# EAGLE board HighVoltageMeasurementModule_1000V_multimax (EAGLE 9.6.2)
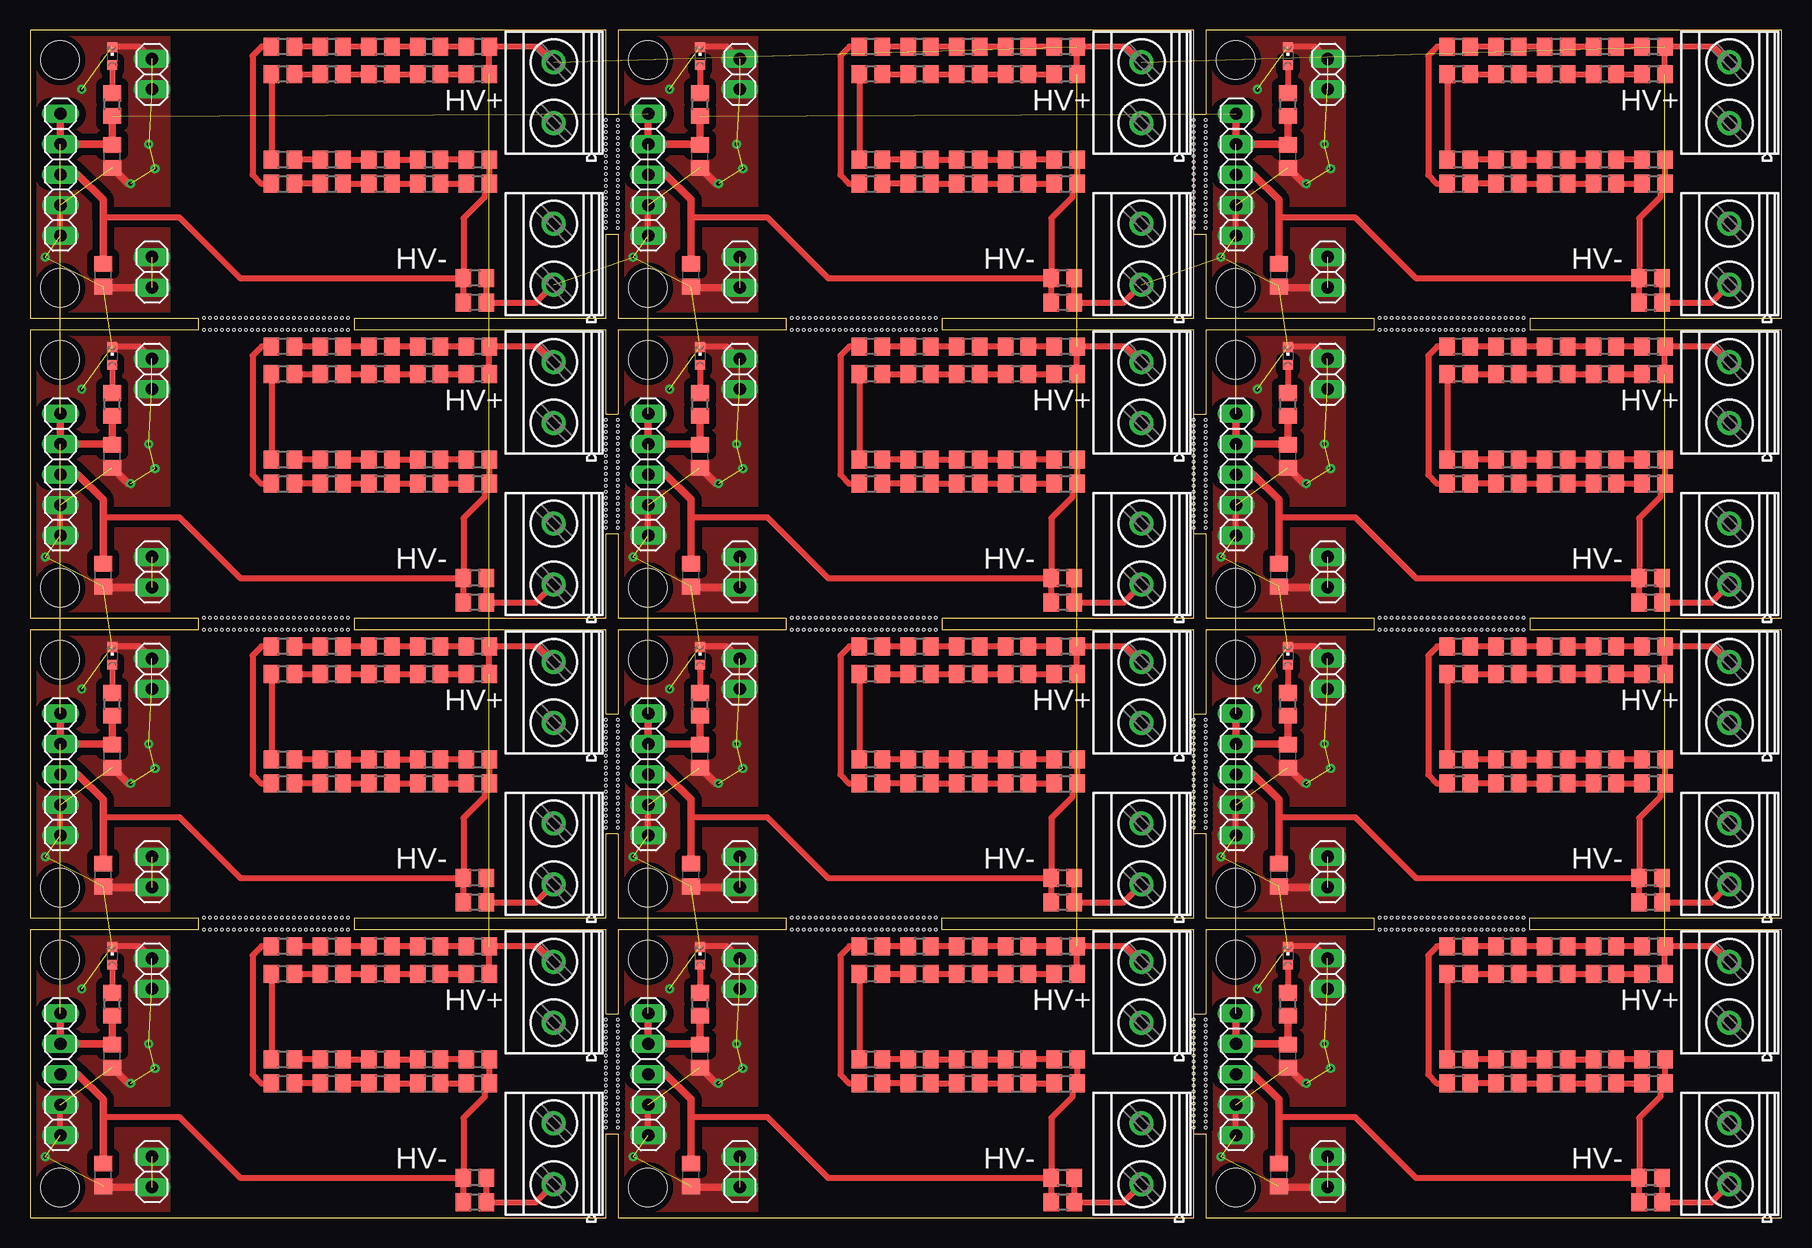
[diagram p3: board, top side]
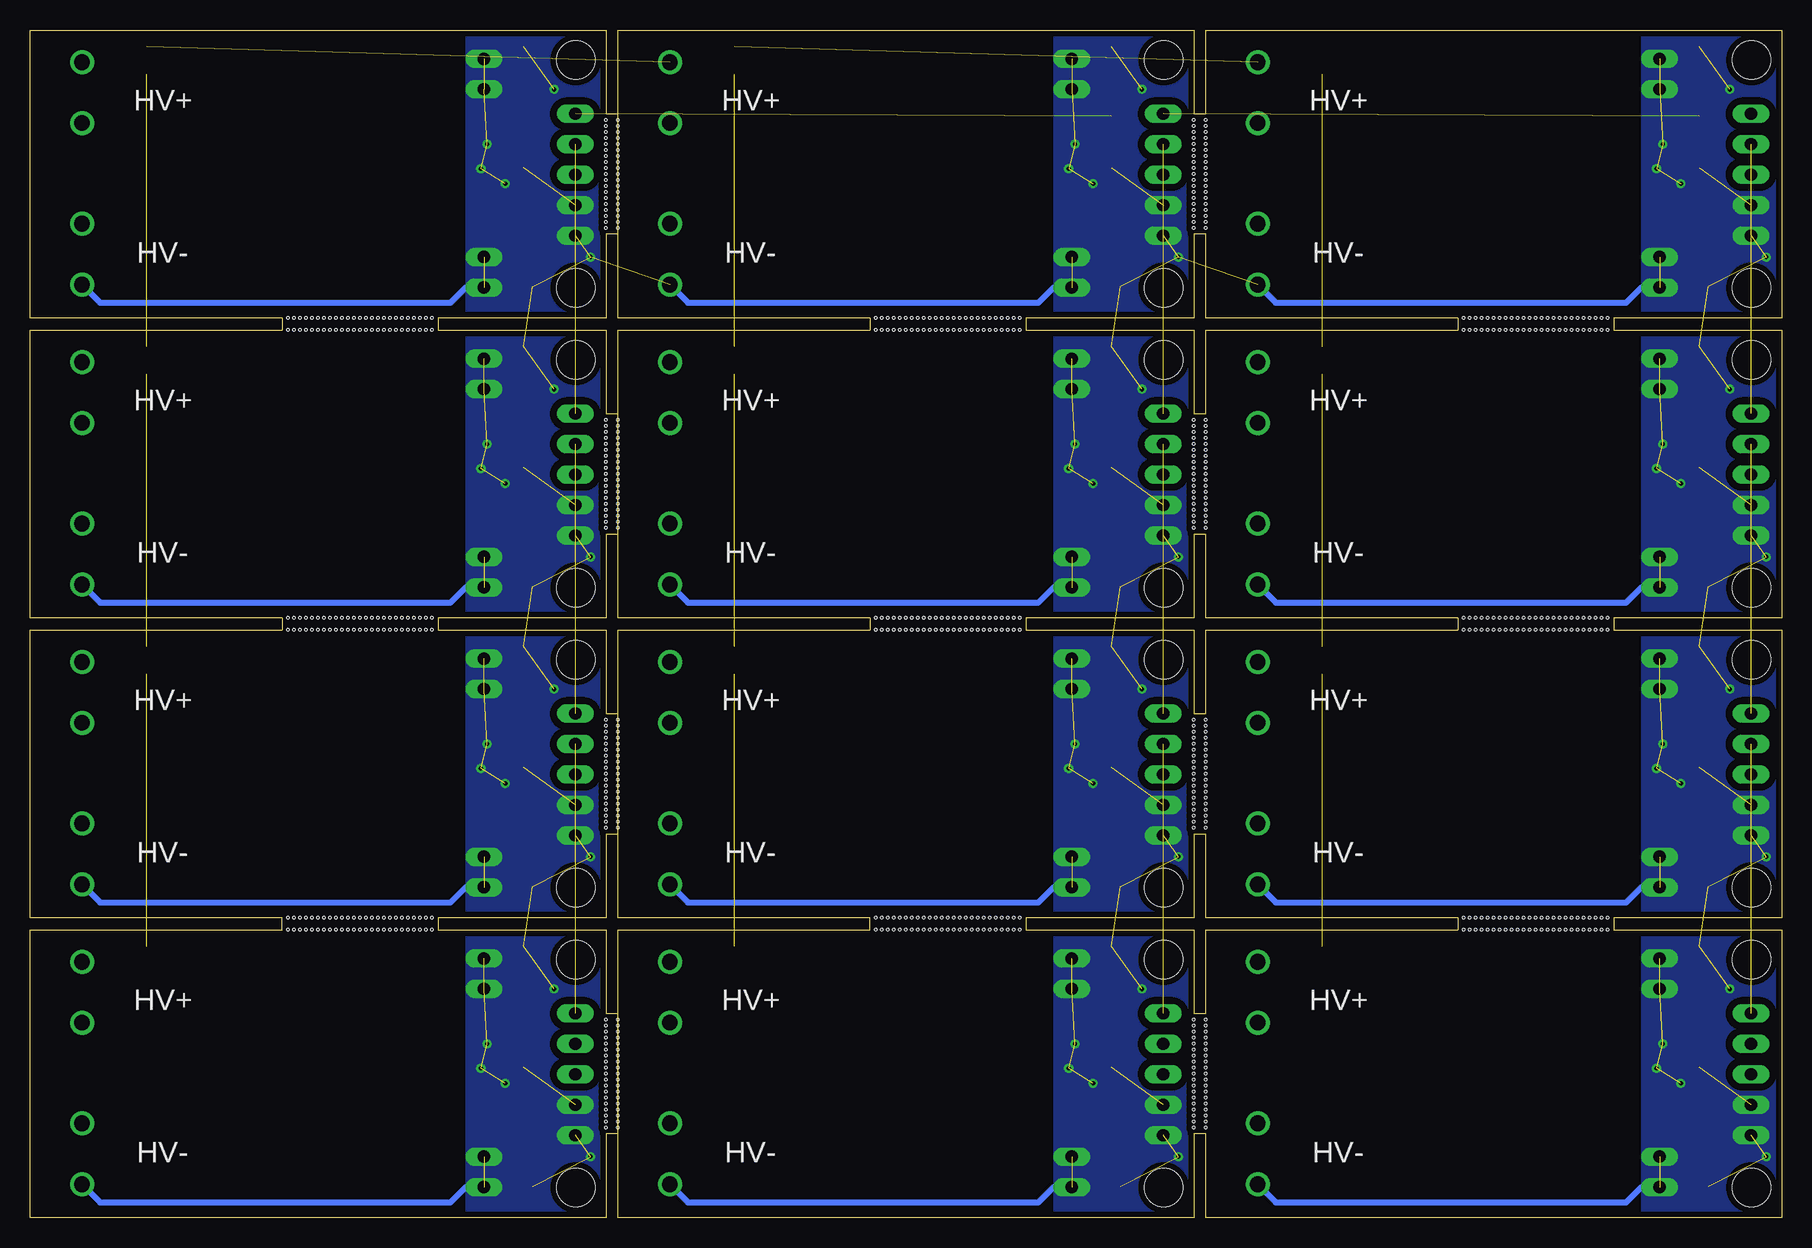
[diagram p4: board, bottom side, seen from below]

Size 146 x 99 mm. Coordinates in mm from the lower left corner, seen from the top.
Outline: 49,0 97,0
Outline: 97,0 97,24
Outline: 97,24 76,24
Outline: 49,0 49,7 48,7 48,0 0,0 0,24 14,24 14,25 0,25 0,49 14,49 14,50 0,50 0,74 14,74 14,75 0,75 0,99 48,99 48,92 49,92 49,99
Outline: 76,25 97,25
Outline: 97,25 97,49
Outline: 97,49 76,49
Outline: 76,50 97,50
Outline: 97,50 97,74
Outline: 97,74 76,74
Outline: 76,75 97,75
Outline: 97,75 97,99
Outline: 97,99 49,99
Outline: 76,75 76,74
Outline: 76,50 76,49
Outline: 76,24 76,25
Outline: 49,0 97,0
Outline: 97,0 97,7 98,7 98,0 146,0 146,24 125,24 125,25 146,25 146,49 125,49 125,50 146,50 146,74 125,74 125,75 146,75 146,99 98,99 98,92 97,92 97,99
Outline: 97,24 97,17 98,17 98,24 112,24 112,25 98,25 98,32 97,32 97,25
Outline: 97,24 76,24
Outline: 76,25 97,25
Outline: 97,49 97,42 98,42 98,49 112,49 112,50 98,50 98,57 97,57 97,50
Outline: 97,49 76,49
Outline: 76,50 97,50
Outline: 97,74 97,67 98,67 98,74 112,74 112,75 98,75 98,82 97,82 97,75
Outline: 97,74 76,74
Outline: 76,75 97,75
Outline: 97,99 49,99
Outline: 48,17 48,24 27,24 27,25 48,25 48,32 49,32 49,25 63,25 63,24 49,24 49,17 48,17
Outline: 48,42 48,49 27,49 27,50 48,50 48,57 49,57 49,50 63,50 63,49 49,49 49,42 48,42
Outline: 48,67 48,74 27,74 27,75 48,75 48,82 49,82 49,75 63,75 63,74 49,74 49,67 48,67
Copper layers (1*16): Top 0.035mm / dielectric 1.5mm / Bottom 0.035mm
Design rules "default *": minimum track width 6mil, minimum drill 0.35mm, track to track 24mil, track to pad 24mil, pad to pad 6mil, via to via 6mil, smd to smd 6mil, copper to edge 20mil, drill to drill 6mil, minimum pad ring 10mil, minimum via ring 8mil, stop-mask expansion 4mil, vias tented up to drill 0mil, thermal gap 10mil
Holes 3.2 mm at 2.5,21.5 2.5,2.5 51.5,21.5 51.5,2.5 2.5,46.5 2.5,27.5 51.5,46.5 51.5,27.5 2.5,71.5 2.5,52.5 51.5,71.5 51.5,52.5 2.5,96.5 2.5,77.5 51.5,96.5 51.5,77.5 100.5,21.5 100.5,2.5 100.5,46.5 100.5,27.5 100.5,71.5 100.5,52.5 100.5,96.5 100.5,77.5
Holes 0.2 mm at 14.5,75 14.5,74 15,74 15.5,74 16,74 16.5,74 17.5,74 17,74 18,74 18.5,74 19,74 19.5,74 20,74 20.5,74 21,74 21.5,74 22,74 23,74 22.5,74 23.5,74 24,74 24.5,74 25.5,74 26,74 25,74 26.5,74 26.5,75 26,75 25.5,75 25,75 24.5,75 24,75 23.5,75 23,75 22.5,75 22,75 21.5,75 21,75 20.5,75 20,75 19.5,75 19,75 18.5,75 18,75 17.5,75 17,75 16.5,75 16,75 15.5,75 15,75 63.5,75 63.5,74 64,74 64.5,74 65,74 65.5,74 66.5,74 66,74 67,74 67.5,74 68,74 68.5,74 69,74 69.5,74 70,74 70.5,74 71,74 72,74 71.5,74 72.5,74 73,74 73.5,74 74.5,74 75,74 74,74 75.5,74 75.5,75 75,75 74.5,75 74,75 73.5,75 73,75 72.5,75 72,75 71.5,75 71,75 70.5,75 70,75 69.5,75 69,75 68.5,75 68,75 67.5,75 67,75 66.5,75 66,75 65.5,75 65,75 64.5,75 64,75 63.5,50 63.5,49 64,49 64.5,49 65,49 65.5,49 66.5,49 66,49 67,49 67.5,49 68,49 68.5,49 69,49 69.5,49 70,49 70.5,49 71,49 72,49 71.5,49 72.5,49 73,49 73.5,49 74.5,49 75,49 74,49 75.5,49 75.5,50 75,50 74.5,50 74,50 73.5,50 73,50 72.5,50 72,50 71.5,50 71,50 70.5,50 70,50 69.5,50 69,50 68.5,50 68,50 67.5,50 67,50 66.5,50 66,50 65.5,50 65,50 64.5,50 64,50 14.5,50 14.5,49 15,49 15.5,49 16,49 16.5,49 17.5,49 17,49 18,49 18.5,49 19,49 19.5,49 20,49 20.5,49 21,49 21.5,49 22,49 23,49 22.5,49 23.5,49 24,49 24.5,49 25.5,49 26,49 25,49 26.5,49 26.5,50 26,50 25.5,50 25,50 24.5,50 24,50 23.5,50 23,50 22.5,50 22,50 21.5,50 21,50 20.5,50 20,50 19.5,50 19,50 18.5,50 18,50 17.5,50 17,50 16.5,50 16,50 15.5,50 15,50 14.5,25 14.5,24 15,24 15.5,24 16,24 16.5,24 17.5,24 17,24 18,24 18.5,24 19,24 19.5,24 20,24 20.5,24 21,24 21.5,24 22,24 23,24 22.5,24 23.5,24 24,24 24.5,24 25.5,24 26,24 25,24 26.5,24 26.5,25 26,25 25.5,25 25,25 24.5,25 24,25 23.5,25 23,25 22.5,25 22,25 21.5,25 21,25 20.5,25 20,25 19.5,25 19,25 18.5,25 18,25 17.5,25 17,25 16.5,25 16,25 15.5,25 15,25 63.5,25 63.5,24 64,24 64.5,24 65,24 65.5,24 66.5,24 66,24 67,24 67.5,24 68,24 68.5,24 69,24 69.5,24 70,24 70.5,24 71,24 72,24 71.5,24 72.5,24 73,24 73.5,24 74.5,24 75,24 74,24 75.5,24 75.5,25 75,25 74.5,25 74,25 73.5,25 73,25 72.5,25 72,25 71.5,25 71,25 70.5,25 70,25 69.5,25 69,25 68.5,25 68,25 67.5,25 67,25 66.5,25 66,25 65.5,25 65,25 64.5,25 64,25 48,7.5 49,7.5 49,8 48,8 48,8.5 49,8.5 49,9 48,9 48,9.5 49,9.5 49,10 49,10.5 49,11 49,11.5 49,12 49,12.5 49,13 49,13.5 49,14 49,15 49,14.5 49,15.5 49,16 49,16.5 48,16.5 48,16 48,15.5 48,15 48,14.5 48,14 48,13.5 48,13 48,12.5 48,12 48,11.5 48,11 48,10.5 48,10 48,32.5 49,32.5 49,33 48,33 48,33.5 49,33.5 49,34 48,34 48,34.5 49,34.5 49,35 49,35.5 49,36 49,36.5 49,37 49,37.5 49,38 49,38.5 49,39 49,40 49,39.5 49,40.5 49,41 49,41.5 48,41.5 48,41 48,40.5 48,40 48,39.5 48,39 48,38.5 48,38 48,37.5 48,37 48,36.5 48,36 48,35.5 48,35 48,57.5 49,57.5 49,58 48,58 48,58.5 49,58.5 49,59 48,59 48,59.5 49,59.5 49,60 49,60.5 49,61 49,61.5 49,62 49,62.5 49,63 49,63.5 49,64 49,65 49,64.5 49,65.5 49,66 49,66.5 48,66.5 48,66 48,65.5 48,65 48,64.5 48,64 48,63.5 48,63 48,62.5 48,62 48,61.5 48,61 48,60.5 48,60 48,82.5 49,82.5 49,83 48,83 48,83.5 49,83.5 49,84 48,84 48,84.5 49,84.5 49,85 49,85.5 49,86 49,86.5 49,87 49,87.5 49,88 49,88.5 49,89 49,90 49,89.5 49,90.5 49,91 49,91.5 48,91.5 48,91 48,90.5 48,90 48,89.5 48,89 48,88.5 48,88 48,87.5 48,87 48,86.5 48,86 48,85.5 48,85 112.5,75 112.5,74 113,74 113.5,74 114,74 114.5,74 115.5,74 115,74 116,74 116.5,74 117,74 117.5,74 118,74 118.5,74 119,74 119.5,74 120,74 121,74 120.5,74 121.5,74 122,74 122.5,74 123.5,74 124,74 123,74 124.5,74 124.5,75 124,75 123.5,75 123,75 122.5,75 122,75 121.5,75 121,75 120.5,75 120,75 119.5,75 119,75 118.5,75 118,75 117.5,75 117,75 116.5,75 116,75 115.5,75 115,75 114.5,75 114,75 113.5,75 113,75 112.5,50 112.5,49 113,49 113.5,49 114,49 114.5,49 115.5,49 115,49 116,49 116.5,49 117,49 117.5,49 118,49 118.5,49 119,49 119.5,49 120,49 121,49 120.5,49 121.5,49 122,49 122.5,49 123.5,49 124,49 123,49 124.5,49 124.5,50 124,50 123.5,50 123,50 122.5,50 122,50 121.5,50 121,50 120.5,50 120,50 119.5,50 119,50 118.5,50 118,50 117.5,50 117,50 116.5,50 116,50 115.5,50 115,50 114.5,50 114,50 113.5,50 113,50 112.5,25 112.5,24 113,24 113.5,24 114,24 114.5,24 115.5,24 115,24 116,24 116.5,24 117,24 117.5,24 118,24 118.5,24 119,24 119.5,24 120,24 121,24 120.5,24 121.5,24 122,24 122.5,24 123.5,24 124,24 123,24 124.5,24 124.5,25 124,25 123.5,25 123,25 122.5,25 122,25 121.5,25 121,25 120.5,25 120,25 119.5,25 119,25 118.5,25 118,25 117.5,25 117,25 116.5,25 116,25 115.5,25 115,25 114.5,25 114,25 113.5,25 113,25 97,7.5 98,7.5 98,8 97,8 97,8.5 98,8.5 98,9 97,9 97,9.5 98,9.5 98,10 98,10.5 98,11 98,11.5 98,12 98,12.5 98,13 98,13.5 98,14 98,15 98,14.5 98,15.5 98,16 98,16.5 97,16.5 97,16 97,15.5 97,15 97,14.5 97,14 97,13.5 97,13 97,12.5 97,12 97,11.5 97,11 97,10.5 97,10 97,32.5 98,32.5 98,33 97,33 97,33.5 98,33.5 98,34 97,34 97,34.5 98,34.5 98,35 98,35.5 98,36 98,36.5 98,37 98,37.5 98,38 98,38.5 98,39 98,40 98,39.5 98,40.5 98,41 98,41.5 97,41.5 97,41 97,40.5 97,40 97,39.5 97,39 97,38.5 97,38 97,37.5 97,37 97,36.5 97,36 97,35.5 97,35 97,57.5 98,57.5 98,58 97,58 97,58.5 98,58.5 98,59 97,59 97,59.5 98,59.5 98,60 98,60.5 98,61 98,61.5 98,62 98,62.5 98,63 98,63.5 98,64 98,65 98,64.5 98,65.5 98,66 98,66.5 97,66.5 97,66 97,65.5 97,65 97,64.5 97,64 97,63.5 97,63 97,62.5 97,62 97,61.5 97,61 97,60.5 97,60 97,82.5 98,82.5 98,83 97,83 97,83.5 98,83.5 98,84 97,84 97,84.5 98,84.5 98,85 98,85.5 98,86 98,86.5 98,87 98,87.5 98,88 98,88.5 98,89 98,90 98,89.5 98,90.5 98,91 98,91.5 97,91.5 97,91 97,90.5 97,90 97,89.5 97,89 97,88.5 97,88 97,87.5 97,87 97,86.5 97,86 97,85.5 97,85

## Footprints (pad centres in the part's own frame; a part is rotated, then mirrored left to right if it is on the bottom)
C0805 = smd 1.3 x 1.5: 1 -0.95,0; 2 0.95,0
1X05 = drill 1.016 long: 1 -5.08,0; 2 -2.54,0; 3 0,0; 4 2.54,0; 5 5.08,0
1X02 = drill 1.016 long: 1 -1.27,0; 2 1.27,0
CHIPLED_0603 = smd 0.8 x 0.8: A 0,-0.75; C 0,0.75
R0805 = smd 1.3 x 1.5: 1 -0.95,0; 2 0.95,0
MKDSN1,5/2-5,08 = drill 1.3 pad 2: 1 -2.561,0.025; 2 2.519,0.025

## Placement (x,y rotation side)
C1  100nF  [C0805]  6.86,13.46 90 top
C2  10nF  [C0805]  6.1,3.56 90 top
C5  100nF  [C0805]  6.86,38.46 90 top
C6  10nF  [C0805]  6.1,28.56 90 top
C7  100nF  [C0805]  6.86,63.46 90 top
C8  10nF  [C0805]  6.1,53.56 90 top
C9  100nF  [C0805]  55.86,13.46 90 top
C10  10nF  [C0805]  55.1,3.56 90 top
C11  100nF  [C0805]  6.86,88.46 90 top
C12  10nF  [C0805]  6.1,78.56 90 top
C13  100nF  [C0805]  55.86,38.46 90 top
C14  10nF  [C0805]  55.1,28.56 90 top
C15  100nF  [C0805]  55.86,63.46 90 top
C16  10nF  [C0805]  55.1,53.56 90 top
C17  100nF  [C0805]  55.86,88.46 90 top
C18  10nF  [C0805]  55.1,78.56 90 top
C25  100nF  [C0805]  104.86,13.46 90 top
C26  10nF  [C0805]  104.1,3.56 90 top
C27  100nF  [C0805]  104.86,38.46 90 top
C28  10nF  [C0805]  104.1,28.56 90 top
C29  100nF  [C0805]  104.86,63.46 90 top
C30  10nF  [C0805]  104.1,53.56 90 top
C31  100nF  [C0805]  104.86,88.46 90 top
C32  10nF  [C0805]  104.1,78.56 90 top
JP1  [1X05]  2.54,11.94 270 top
JP2  [1X02]  10.16,20.32 90 top
JP3  [1X02]  10.16,3.81 270 top
JP7  [1X05]  2.54,36.94 270 top
JP8  [1X02]  10.16,45.32 90 top
JP9  [1X02]  10.16,28.81 270 top
JP10  [1X05]  2.54,61.94 270 top
JP11  [1X02]  10.16,70.32 90 top
JP12  [1X02]  10.16,53.81 270 top
JP13  [1X05]  51.54,11.94 270 top
JP14  [1X02]  59.16,20.32 90 top
JP15  [1X02]  59.16,3.81 270 top
JP16  [1X05]  2.54,86.94 270 top
JP17  [1X02]  10.16,95.32 90 top
JP18  [1X02]  10.16,78.81 270 top
JP19  [1X05]  51.54,36.94 270 top
JP20  [1X02]  59.16,45.32 90 top
JP21  [1X02]  59.16,28.81 270 top
JP22  [1X05]  51.54,61.94 270 top
JP23  [1X02]  59.16,70.32 90 top
JP24  [1X02]  59.16,53.81 270 top
JP25  [1X05]  51.54,86.94 270 top
JP26  [1X02]  59.16,95.32 90 top
JP27  [1X02]  59.16,78.81 270 top
JP37  [1X05]  100.54,11.94 270 top
JP38  [1X02]  108.16,20.32 90 top
JP39  [1X02]  108.16,3.81 270 top
JP40  [1X05]  100.54,36.94 270 top
JP41  [1X02]  108.16,45.32 90 top
JP42  [1X02]  108.16,28.81 270 top
JP43  [1X05]  100.54,61.94 270 top
JP44  [1X02]  108.16,70.32 90 top
JP45  [1X02]  108.16,53.81 270 top
JP46  [1X05]  100.54,86.94 270 top
JP47  [1X02]  108.16,95.32 90 top
JP48  [1X02]  108.16,78.81 270 top
LED1  KT-0603R  [CHIPLED_0603]  6.86,21.84 0 top
LED3  KT-0603R  [CHIPLED_0603]  6.86,46.84 0 top
LED4  KT-0603R  [CHIPLED_0603]  6.86,71.84 0 top
LED5  KT-0603R  [CHIPLED_0603]  55.86,21.84 0 top
LED6  KT-0603R  [CHIPLED_0603]  6.86,96.84 0 top
LED7  KT-0603R  [CHIPLED_0603]  55.86,46.84 0 top
LED8  KT-0603R  [CHIPLED_0603]  55.86,71.84 0 top
LED9  KT-0603R  [CHIPLED_0603]  55.86,96.84 0 top
LED13  KT-0603R  [CHIPLED_0603]  104.86,21.84 0 top
LED14  KT-0603R  [CHIPLED_0603]  104.86,46.84 0 top
LED15  KT-0603R  [CHIPLED_0603]  104.86,71.84 0 top
LED16  KT-0603R  [CHIPLED_0603]  104.86,96.84 0 top
R1  1k  [R0805]  6.86,17.78 90 top
R2  200k  [R0805]  37.34,20.32 180 top
R3  200k  [R0805]  37.34,22.61 180 top
R4  200k  [R0805]  33.27,20.32 180 top
R5  200k  [R0805]  29.21,20.32 180 top
R6  200k  [R0805]  25.15,20.32 180 top
R7  200k  [R0805]  21.08,20.32 180 top
R8  200k  [R0805]  33.27,22.61 180 top
R9  200k  [R0805]  21.08,13.21 0 top
R10  200k  [R0805]  25.15,13.21 0 top
R11  200k  [R0805]  29.21,13.21 0 top
R12  200k  [R0805]  33.27,13.21 0 top
R13  200k  [R0805]  29.21,22.61 180 top
R14  200k  [R0805]  37.34,13.21 0 top
R15  10k  [R0805]  37.08,1.27 180 top
R18  200k  [R0805]  25.15,22.61 180 top
R23  200k  [R0805]  21.08,22.61 180 top
R28  200k  [R0805]  21.08,11.18 0 top
R33  200k  [R0805]  25.15,11.18 0 top
R38  200k  [R0805]  29.21,11.18 0 top
R43  200k  [R0805]  33.27,11.18 0 top
R45  200k  [R0805]  37.34,11.18 0 top
R46  1k  [R0805]  6.86,42.78 90 top
R47  200k  [R0805]  37.34,47.61 180 top
R48  200k  [R0805]  33.27,47.61 180 top
R49  200k  [R0805]  29.21,47.61 180 top
R50  200k  [R0805]  25.15,47.61 180 top
R51  200k  [R0805]  21.08,47.61 180 top
R52  200k  [R0805]  21.08,36.18 0 top
R53  10k  [R0805]  37.08,3.3 180 top
R54  200k  [R0805]  25.15,36.18 0 top
R55  200k  [R0805]  29.21,36.18 0 top
R56  200k  [R0805]  33.27,36.18 0 top
R57  200k  [R0805]  37.34,36.18 0 top
R58  10k  [R0805]  37.08,28.3 180 top
R59  200k  [R0805]  37.34,45.32 180 top
R60  200k  [R0805]  33.27,45.32 180 top
R61  200k  [R0805]  29.21,45.32 180 top
R62  200k  [R0805]  25.15,45.32 180 top
R63  200k  [R0805]  21.08,45.32 180 top
R64  200k  [R0805]  21.08,38.21 0 top
R65  200k  [R0805]  25.15,38.21 0 top
R66  200k  [R0805]  29.21,38.21 0 top
R67  200k  [R0805]  33.27,38.21 0 top
R68  200k  [R0805]  37.34,38.21 0 top
R69  10k  [R0805]  37.08,26.27 180 top
R70  1k  [R0805]  6.86,67.78 90 top
R71  200k  [R0805]  37.34,72.61 180 top
R72  200k  [R0805]  33.27,72.61 180 top
R73  200k  [R0805]  29.21,72.61 180 top
R74  200k  [R0805]  25.15,72.61 180 top
R75  200k  [R0805]  21.08,72.61 180 top
R76  200k  [R0805]  21.08,61.18 0 top
R77  200k  [R0805]  25.15,61.18 0 top
R78  200k  [R0805]  29.21,61.18 0 top
R79  200k  [R0805]  33.27,61.18 0 top
R80  200k  [R0805]  37.34,61.18 0 top
R81  10k  [R0805]  37.08,53.3 180 top
R82  200k  [R0805]  37.34,70.32 180 top
R83  200k  [R0805]  33.27,70.32 180 top
R84  200k  [R0805]  29.21,70.32 180 top
R85  200k  [R0805]  25.15,70.32 180 top
R86  200k  [R0805]  21.08,70.32 180 top
R87  200k  [R0805]  21.08,63.21 0 top
R88  200k  [R0805]  25.15,63.21 0 top
R89  200k  [R0805]  29.21,63.21 0 top
R90  200k  [R0805]  33.27,63.21 0 top
R91  200k  [R0805]  37.34,63.21 0 top
R92  10k  [R0805]  37.08,51.27 180 top
R93  1k  [R0805]  55.86,17.78 90 top
R94  200k  [R0805]  86.34,22.61 180 top
R95  200k  [R0805]  82.27,22.61 180 top
R96  200k  [R0805]  78.21,22.61 180 top
R97  200k  [R0805]  74.15,22.61 180 top
R98  200k  [R0805]  70.08,22.61 180 top
R99  200k  [R0805]  70.08,11.18 0 top
R100  200k  [R0805]  74.15,11.18 0 top
R101  200k  [R0805]  78.21,11.18 0 top
R102  200k  [R0805]  82.27,11.18 0 top
R103  200k  [R0805]  86.34,11.18 0 top
R104  10k  [R0805]  86.08,3.3 180 top
R105  200k  [R0805]  86.34,20.32 180 top
R106  200k  [R0805]  82.27,20.32 180 top
R107  200k  [R0805]  78.21,20.32 180 top
R108  200k  [R0805]  74.15,20.32 180 top
R109  200k  [R0805]  70.08,20.32 180 top
R110  200k  [R0805]  70.08,13.21 0 top
R111  200k  [R0805]  74.15,13.21 0 top
R112  200k  [R0805]  78.21,13.21 0 top
R113  200k  [R0805]  82.27,13.21 0 top
R114  200k  [R0805]  86.34,13.21 0 top
R115  10k  [R0805]  86.08,1.27 180 top
R116  1k  [R0805]  6.86,92.78 90 top
R117  200k  [R0805]  37.34,97.61 180 top
R118  200k  [R0805]  33.27,97.61 180 top
R119  200k  [R0805]  29.21,97.61 180 top
R120  200k  [R0805]  25.15,97.61 180 top
R121  200k  [R0805]  21.08,97.61 180 top
R122  200k  [R0805]  21.08,86.18 0 top
R123  200k  [R0805]  25.15,86.18 0 top
R124  200k  [R0805]  29.21,86.18 0 top
R125  200k  [R0805]  33.27,86.18 0 top
R126  200k  [R0805]  37.34,86.18 0 top
R127  10k  [R0805]  37.08,78.3 180 top
R128  200k  [R0805]  37.34,95.32 180 top
R129  200k  [R0805]  33.27,95.32 180 top
R130  200k  [R0805]  29.21,95.32 180 top
R131  200k  [R0805]  25.15,95.32 180 top
R132  200k  [R0805]  21.08,95.32 180 top
R133  200k  [R0805]  21.08,88.21 0 top
R134  200k  [R0805]  25.15,88.21 0 top
R135  200k  [R0805]  29.21,88.21 0 top
R136  200k  [R0805]  33.27,88.21 0 top
R137  200k  [R0805]  37.34,88.21 0 top
R138  10k  [R0805]  37.08,76.27 180 top
R139  1k  [R0805]  55.86,42.78 90 top
R140  200k  [R0805]  86.34,47.61 180 top
R141  200k  [R0805]  82.27,47.61 180 top
R142  200k  [R0805]  78.21,47.61 180 top
R143  200k  [R0805]  74.15,47.61 180 top
R144  200k  [R0805]  70.08,47.61 180 top
R145  200k  [R0805]  70.08,36.18 0 top
R146  200k  [R0805]  74.15,36.18 0 top
R147  200k  [R0805]  78.21,36.18 0 top
R148  200k  [R0805]  82.27,36.18 0 top
R149  200k  [R0805]  86.34,36.18 0 top
R150  10k  [R0805]  86.08,28.3 180 top
R151  200k  [R0805]  86.34,45.32 180 top
R152  200k  [R0805]  82.27,45.32 180 top
R153  200k  [R0805]  78.21,45.32 180 top
R154  200k  [R0805]  74.15,45.32 180 top
R155  200k  [R0805]  70.08,45.32 180 top
R156  200k  [R0805]  70.08,38.21 0 top
R157  200k  [R0805]  74.15,38.21 0 top
R158  200k  [R0805]  78.21,38.21 0 top
R159  200k  [R0805]  82.27,38.21 0 top
R160  200k  [R0805]  86.34,38.21 0 top
R161  10k  [R0805]  86.08,26.27 180 top
R162  1k  [R0805]  55.86,67.78 90 top
R163  200k  [R0805]  86.34,72.61 180 top
R164  200k  [R0805]  82.27,72.61 180 top
R165  200k  [R0805]  78.21,72.61 180 top
R166  200k  [R0805]  74.15,72.61 180 top
R167  200k  [R0805]  70.08,72.61 180 top
R168  200k  [R0805]  70.08,61.18 0 top
R169  200k  [R0805]  74.15,61.18 0 top
R170  200k  [R0805]  78.21,61.18 0 top
R171  200k  [R0805]  82.27,61.18 0 top
R172  200k  [R0805]  86.34,61.18 0 top
R173  10k  [R0805]  86.08,53.3 180 top
R174  200k  [R0805]  86.34,70.32 180 top
R175  200k  [R0805]  82.27,70.32 180 top
R176  200k  [R0805]  78.21,70.32 180 top
R177  200k  [R0805]  74.15,70.32 180 top
R178  200k  [R0805]  70.08,70.32 180 top
R179  200k  [R0805]  70.08,63.21 0 top
R180  200k  [R0805]  74.15,63.21 0 top
R181  200k  [R0805]  78.21,63.21 0 top
R182  200k  [R0805]  82.27,63.21 0 top
R183  200k  [R0805]  86.34,63.21 0 top
R184  10k  [R0805]  86.08,51.27 180 top
R185  1k  [R0805]  55.86,92.78 90 top
R186  200k  [R0805]  86.34,97.61 180 top
R187  200k  [R0805]  82.27,97.61 180 top
R188  200k  [R0805]  78.21,97.61 180 top
R189  200k  [R0805]  74.15,97.61 180 top
R190  200k  [R0805]  70.08,97.61 180 top
R191  200k  [R0805]  70.08,86.18 0 top
R192  200k  [R0805]  74.15,86.18 0 top
R193  200k  [R0805]  78.21,86.18 0 top
R194  200k  [R0805]  82.27,86.18 0 top
R195  200k  [R0805]  86.34,86.18 0 top
R196  10k  [R0805]  86.08,78.3 180 top
R197  200k  [R0805]  86.34,95.32 180 top
R198  200k  [R0805]  82.27,95.32 180 top
R199  200k  [R0805]  78.21,95.32 180 top
R200  200k  [R0805]  74.15,95.32 180 top
R201  200k  [R0805]  70.08,95.32 180 top
R202  200k  [R0805]  70.08,88.21 0 top
R203  200k  [R0805]  74.15,88.21 0 top
R204  200k  [R0805]  78.21,88.21 0 top
R205  200k  [R0805]  82.27,88.21 0 top
R206  200k  [R0805]  86.34,88.21 0 top
R207  10k  [R0805]  86.08,76.27 180 top
R277  1k  [R0805]  104.86,17.78 90 top
R278  200k  [R0805]  135.34,22.61 180 top
R279  200k  [R0805]  131.27,22.61 180 top
R280  200k  [R0805]  127.21,22.61 180 top
R281  200k  [R0805]  123.15,22.61 180 top
R282  200k  [R0805]  119.08,22.61 180 top
R283  200k  [R0805]  119.08,11.18 0 top
R284  200k  [R0805]  123.15,11.18 0 top
R285  200k  [R0805]  127.21,11.18 0 top
R286  200k  [R0805]  131.27,11.18 0 top
R287  200k  [R0805]  135.34,11.18 0 top
R288  10k  [R0805]  135.08,3.3 180 top
R289  200k  [R0805]  135.34,20.32 180 top
R290  200k  [R0805]  131.27,20.32 180 top
R291  200k  [R0805]  127.21,20.32 180 top
R292  200k  [R0805]  123.15,20.32 180 top
R293  200k  [R0805]  119.08,20.32 180 top
R294  200k  [R0805]  119.08,13.21 0 top
R295  200k  [R0805]  123.15,13.21 0 top
R296  200k  [R0805]  127.21,13.21 0 top
R297  200k  [R0805]  131.27,13.21 0 top
R298  200k  [R0805]  135.34,13.21 0 top
R299  10k  [R0805]  135.08,1.27 180 top
R300  1k  [R0805]  104.86,42.78 90 top
R301  200k  [R0805]  135.34,47.61 180 top
R302  200k  [R0805]  131.27,47.61 180 top
R303  200k  [R0805]  127.21,47.61 180 top
R304  200k  [R0805]  123.15,47.61 180 top
R305  200k  [R0805]  119.08,47.61 180 top
R306  200k  [R0805]  119.08,36.18 0 top
R307  200k  [R0805]  123.15,36.18 0 top
R308  200k  [R0805]  127.21,36.18 0 top
R309  200k  [R0805]  131.27,36.18 0 top
R310  200k  [R0805]  135.34,36.18 0 top
R311  10k  [R0805]  135.08,28.3 180 top
R312  200k  [R0805]  135.34,45.32 180 top
R313  200k  [R0805]  131.27,45.32 180 top
R314  200k  [R0805]  127.21,45.32 180 top
R315  200k  [R0805]  123.15,45.32 180 top
R316  200k  [R0805]  119.08,45.32 180 top
R317  200k  [R0805]  119.08,38.21 0 top
R318  200k  [R0805]  123.15,38.21 0 top
R319  200k  [R0805]  127.21,38.21 0 top
R320  200k  [R0805]  131.27,38.21 0 top
R321  200k  [R0805]  135.34,38.21 0 top
R322  10k  [R0805]  135.08,26.27 180 top
R323  1k  [R0805]  104.86,67.78 90 top
R324  200k  [R0805]  135.34,72.61 180 top
R325  200k  [R0805]  131.27,72.61 180 top
R326  200k  [R0805]  127.21,72.61 180 top
R327  200k  [R0805]  123.15,72.61 180 top
R328  200k  [R0805]  119.08,72.61 180 top
R329  200k  [R0805]  119.08,61.18 0 top
R330  200k  [R0805]  123.15,61.18 0 top
R331  200k  [R0805]  127.21,61.18 0 top
R332  200k  [R0805]  131.27,61.18 0 top
R333  200k  [R0805]  135.34,61.18 0 top
R334  10k  [R0805]  135.08,53.3 180 top
R335  200k  [R0805]  135.34,70.32 180 top
R336  200k  [R0805]  131.27,70.32 180 top
R337  200k  [R0805]  127.21,70.32 180 top
R338  200k  [R0805]  123.15,70.32 180 top
R339  200k  [R0805]  119.08,70.32 180 top
R340  200k  [R0805]  119.08,63.21 0 top
R341  200k  [R0805]  123.15,63.21 0 top
R342  200k  [R0805]  127.21,63.21 0 top
R343  200k  [R0805]  131.27,63.21 0 top
R344  200k  [R0805]  135.34,63.21 0 top
R345  10k  [R0805]  135.08,51.27 180 top
R346  1k  [R0805]  104.86,92.78 90 top
R347  200k  [R0805]  135.34,97.61 180 top
R348  200k  [R0805]  131.27,97.61 180 top
R349  200k  [R0805]  127.21,97.61 180 top
R350  200k  [R0805]  123.15,97.61 180 top
R351  200k  [R0805]  119.08,97.61 180 top
R352  200k  [R0805]  119.08,86.18 0 top
R353  200k  [R0805]  123.15,86.18 0 top
R354  200k  [R0805]  127.21,86.18 0 top
R355  200k  [R0805]  131.27,86.18 0 top
R356  200k  [R0805]  135.34,86.18 0 top
R357  10k  [R0805]  135.08,78.3 180 top
R358  200k  [R0805]  135.34,95.32 180 top
R359  200k  [R0805]  131.27,95.32 180 top
R360  200k  [R0805]  127.21,95.32 180 top
R361  200k  [R0805]  123.15,95.32 180 top
R362  200k  [R0805]  119.08,95.32 180 top
R363  200k  [R0805]  119.08,88.21 0 top
R364  200k  [R0805]  123.15,88.21 0 top
R365  200k  [R0805]  127.21,88.21 0 top
R366  200k  [R0805]  131.27,88.21 0 top
R367  200k  [R0805]  135.34,88.21 0 top
R368  10k  [R0805]  135.08,76.27 180 top
X1  MKDSN1,5/2-5,08  [MKDSN1,5/2-5,08]  43.69,18.8 90 top
X2  MKDSN1,5/2-5,08  [MKDSN1,5/2-5,08]  43.69,5.33 90 top
X5  MKDSN1,5/2-5,08  [MKDSN1,5/2-5,08]  43.69,43.8 90 top
X6  MKDSN1,5/2-5,08  [MKDSN1,5/2-5,08]  43.69,30.33 90 top
X7  MKDSN1,5/2-5,08  [MKDSN1,5/2-5,08]  43.69,68.8 90 top
X8  MKDSN1,5/2-5,08  [MKDSN1,5/2-5,08]  43.69,55.33 90 top
X9  MKDSN1,5/2-5,08  [MKDSN1,5/2-5,08]  92.69,18.8 90 top
X10  MKDSN1,5/2-5,08  [MKDSN1,5/2-5,08]  92.69,5.33 90 top
X11  MKDSN1,5/2-5,08  [MKDSN1,5/2-5,08]  43.69,93.8 90 top
X12  MKDSN1,5/2-5,08  [MKDSN1,5/2-5,08]  43.69,80.33 90 top
X13  MKDSN1,5/2-5,08  [MKDSN1,5/2-5,08]  92.69,43.8 90 top
X14  MKDSN1,5/2-5,08  [MKDSN1,5/2-5,08]  92.69,30.33 90 top
X15  MKDSN1,5/2-5,08  [MKDSN1,5/2-5,08]  92.69,68.8 90 top
X16  MKDSN1,5/2-5,08  [MKDSN1,5/2-5,08]  92.69,55.33 90 top
X17  MKDSN1,5/2-5,08  [MKDSN1,5/2-5,08]  92.69,93.8 90 top
X18  MKDSN1,5/2-5,08  [MKDSN1,5/2-5,08]  92.69,80.33 90 top
X25  MKDSN1,5/2-5,08  [MKDSN1,5/2-5,08]  141.69,18.8 90 top
X26  MKDSN1,5/2-5,08  [MKDSN1,5/2-5,08]  141.69,5.33 90 top
X27  MKDSN1,5/2-5,08  [MKDSN1,5/2-5,08]  141.69,43.8 90 top
X28  MKDSN1,5/2-5,08  [MKDSN1,5/2-5,08]  141.69,30.33 90 top
X29  MKDSN1,5/2-5,08  [MKDSN1,5/2-5,08]  141.69,68.8 90 top
X30  MKDSN1,5/2-5,08  [MKDSN1,5/2-5,08]  141.69,55.33 90 top
X31  MKDSN1,5/2-5,08  [MKDSN1,5/2-5,08]  141.69,93.8 90 top
X32  MKDSN1,5/2-5,08  [MKDSN1,5/2-5,08]  141.69,80.33 90 top

## Tracks (layer width: path | path; a pad name or v marks a point on that pad's centre or on a via)
5VDC  (11 unrouted)
  Top 0.61: JP1.1 JP1.2 6.79,14.48 C1.2 R1.1 | JP7.1 JP7.2 6.79,39.48 C5.2 R46.1 | JP10.1 JP10.2 6.79,64.48 C7.2 R70.1 | JP16.1 JP16.2 6.79,89.48 C11.2 R116.1 | JP13.1 JP13.2 55.79,14.48 C9.2 R93.1 | JP19.1 JP19.2 55.79,39.48 C13.2 R139.1 | JP22.1 JP22.2 55.79,64.48 C15.2 R162.1 | JP25.1 JP25.2 55.79,89.48 C17.2 R185.1 | JP37.1 JP37.2 104.79,14.48 C25.2 R277.1 | JP40.1 JP40.2 104.79,39.48 C27.2 R300.1 | JP43.1 JP43.2 104.79,64.48 C29.2 R323.1 | JP46.1 JP46.2 104.79,89.48 C31.2 R346.1
GND  (via drill 0.35)  (119 unrouted)
  Top 0.508: JP2.2 9.16,22.59 LED1.C | JP1.5 JP1.4 | R53.1 R15.1 42.16,1.27 X2.1 | JP8.2 9.16,47.59 LED3.C | JP7.5 JP7.4 | R58.1 R69.1 42.16,26.27 X6.1 | JP11.2 9.16,72.59 LED4.C | JP10.5 JP10.4 | R81.1 R92.1 42.16,51.27 X8.1 | JP17.2 9.16,97.59 LED6.C | JP16.5 JP16.4 | R127.1 R138.1 42.16,76.27 X12.1 | JP14.2 58.16,22.59 LED5.C | JP13.5 JP13.4 | R104.1 R115.1 91.16,1.27 X10.1 | JP20.2 58.16,47.59 LED7.C | JP19.5 JP19.4 | R150.1 R161.1 91.16,26.27 X14.1 | JP23.2 58.16,72.59 LED8.C | JP22.5 JP22.4 | R173.1 R184.1 91.16,51.27 X16.1 | JP26.2 58.16,97.59 LED9.C | JP25.5 JP25.4 | R196.1 R207.1 91.16,76.27 X18.1 | JP38.2 107.16,22.59 LED13.C | JP37.5 JP37.4 | R288.1 R299.1 140.16,1.27 X26.1 | JP41.2 107.16,47.59 LED14.C | JP40.5 JP40.4 | R311.1 R322.1 140.16,26.27 X28.1 | JP44.2 107.16,72.59 LED15.C | JP43.5 JP43.4 | R334.1 R345.1 140.16,51.27 X30.1 | JP47.2 107.16,97.59 LED16.C | JP46.5 JP46.4 | R357.1 R368.1 140.16,76.27 X32.1
  Top 0.61: C2.1 6.16,2.54 JP3.2 | C1.1 8.19,11.18 v8.38,11.18 | C6.1 6.16,27.54 JP9.2 | C5.1 8.19,36.18 v8.38,36.18 | C8.1 6.16,52.54 JP12.2 | C7.1 8.19,61.18 v8.38,61.18 | C12.1 6.16,77.54 JP18.2 | C11.1 8.19,86.18 v8.38,86.18 | C10.1 55.16,2.54 JP15.2 | C9.1 57.19,11.18 v57.38,11.18 | C14.1 55.16,27.54 JP21.2 | C13.1 57.19,36.18 v57.38,36.18 | C16.1 55.16,52.54 JP24.2 | C15.1 57.19,61.18 v57.38,61.18 | C18.1 55.16,77.54 JP27.2 | C17.1 57.19,86.18 v57.38,86.18 | C26.1 104.16,2.54 JP39.2 | C25.1 106.19,11.18 v106.38,11.18 | C28.1 104.16,27.54 JP42.2 | C27.1 106.19,36.18 v106.38,36.18 | C30.1 104.16,52.54 JP45.2 | C29.1 106.19,61.18 v106.38,61.18 | C32.1 104.16,77.54 JP48.2 | C31.1 106.19,86.18 v106.38,86.18
  Bottom 0.508: X2.1 42.16,1.27 12.95,1.27 11.68,2.54 JP3.2 | X6.1 42.16,26.27 12.95,26.27 11.68,27.54 JP9.2 | X8.1 42.16,51.27 12.95,51.27 11.68,52.54 JP12.2 | X12.1 42.16,76.27 12.95,76.27 11.68,77.54 JP18.2 | X10.1 91.16,1.27 61.95,1.27 60.68,2.54 JP15.2 | X14.1 91.16,26.27 61.95,26.27 60.68,27.54 JP21.2 | X16.1 91.16,51.27 61.95,51.27 60.68,52.54 JP24.2 | X18.1 91.16,76.27 61.95,76.27 60.68,77.54 JP27.2 | X26.1 140.16,1.27 110.95,1.27 109.68,2.54 JP39.2 | X28.1 140.16,26.27 110.95,26.27 109.68,27.54 JP42.2 | X30.1 140.16,51.27 110.95,51.27 109.68,52.54 JP45.2 | X32.1 140.16,76.27 110.95,76.27 109.68,77.54 JP48.2
  other vias: 9.91,14.48 10.41,12.45 4.32,19.05 1.27,5.08 9.91,39.48 10.41,37.45 4.32,44.05 1.27,30.08 9.91,64.48 10.41,62.45 4.32,69.05 1.27,55.08 9.91,89.48 10.41,87.45 4.32,94.05 1.27,80.08 58.91,14.48 59.41,12.45 53.32,19.05 50.27,5.08 58.91,39.48 59.41,37.45 53.32,44.05 50.27,30.08 58.91,64.48 59.41,62.45 53.32,69.05 50.27,55.08 58.91,89.48 59.41,87.45 53.32,94.05 50.27,80.08 107.91,14.48 108.41,12.45 102.32,19.05 99.27,5.08 107.91,39.48 108.41,37.45 102.32,44.05 99.27,30.08 107.91,64.48 108.41,62.45 102.32,69.05 99.27,55.08 107.91,89.48 108.41,87.45 102.32,94.05 99.27,80.08
  pour Top (no thermals): -0.25,24.13 11.68,24.13 11.68,-0.25 -0.25,-0.25
  pour Bottom (no thermals): 11.18,24.13 11.68,24.13 11.68,-0.25 -0.25,-0.25 -0.25,24.13 10.16,24.13
  pour Top (no thermals): -0.25,49.13 11.68,49.13 11.68,24.75 -0.25,24.75
  pour Bottom (no thermals): 11.18,49.13 11.68,49.13 11.68,24.75 -0.25,24.75 -0.25,49.13 10.16,49.13
  pour Top (no thermals): -0.25,74.13 11.68,74.13 11.68,49.75 -0.25,49.75
  pour Bottom (no thermals): 11.18,74.13 11.68,74.13 11.68,49.75 -0.25,49.75 -0.25,74.13 10.16,74.13
  pour Top (no thermals): -0.25,99.13 11.68,99.13 11.68,74.75 -0.25,74.75
  pour Bottom (no thermals): 11.18,99.13 11.68,99.13 11.68,74.75 -0.25,74.75 -0.25,99.13 10.16,99.13
  pour Top (no thermals): 48.75,24.13 60.68,24.13 60.68,-0.25 48.75,-0.25
  pour Bottom (no thermals): 60.18,24.13 60.68,24.13 60.68,-0.25 48.75,-0.25 48.75,24.13 59.16,24.13
  pour Top (no thermals): 48.75,49.13 60.68,49.13 60.68,24.75 48.75,24.75
  pour Bottom (no thermals): 60.18,49.13 60.68,49.13 60.68,24.75 48.75,24.75 48.75,49.13 59.16,49.13
  pour Top (no thermals): 48.75,74.13 60.68,74.13 60.68,49.75 48.75,49.75
  pour Bottom (no thermals): 60.18,74.13 60.68,74.13 60.68,49.75 48.75,49.75 48.75,74.13 59.16,74.13
  pour Top (no thermals): 48.75,99.13 60.68,99.13 60.68,74.75 48.75,74.75
  pour Bottom (no thermals): 60.18,99.13 60.68,99.13 60.68,74.75 48.75,74.75 48.75,99.13 59.16,99.13
  pour Top (no thermals): 97.75,24.13 109.68,24.13 109.68,-0.25 97.75,-0.25
  pour Bottom (no thermals): 109.18,24.13 109.68,24.13 109.68,-0.25 97.75,-0.25 97.75,24.13 108.16,24.13
  pour Top (no thermals): 97.75,49.13 109.68,49.13 109.68,24.75 97.75,24.75
  pour Bottom (no thermals): 109.18,49.13 109.68,49.13 109.68,24.75 97.75,24.75 97.75,49.13 108.16,49.13
  pour Top (no thermals): 97.75,74.13 109.68,74.13 109.68,49.75 97.75,49.75
  pour Bottom (no thermals): 109.18,74.13 109.68,74.13 109.68,49.75 97.75,49.75 97.75,74.13 108.16,74.13
  pour Top (no thermals): 97.75,99.13 109.68,99.13 109.68,74.75 97.75,74.75
  pour Bottom (no thermals): 109.18,99.13 109.68,99.13 109.68,74.75 97.75,74.75 97.75,99.13 108.16,99.13
HV+  (11 unrouted)
  Top 0.508: R2.1 R3.1 42.37,22.61 X1.2 | R59.1 R47.1 42.37,47.61 X5.2 | R82.1 R71.1 42.37,72.61 X7.2 | R128.1 R117.1 42.37,97.61 X11.2 | R105.1 R94.1 91.37,22.61 X9.2 | R151.1 R140.1 91.37,47.61 X13.2 | R174.1 R163.1 91.37,72.61 X15.2 | R197.1 R186.1 91.37,97.61 X17.2 | R289.1 R278.1 140.37,22.61 X25.2 | R312.1 R301.1 140.37,47.61 X27.2 | R335.1 R324.1 140.37,72.61 X29.2 | R358.1 R347.1 140.37,97.61 X31.2
N$1
  Top 0.508: R4.1 R2.2
N$2
  Top 0.508: R5.1 R4.2
N$3
  Top 0.508: R6.1 R5.2
N$4
  Top 0.508: R7.1 R6.2
N$5
  Top 0.508: LED1.A R1.2
N$7
  Top 0.508: R7.2 R9.1
N$8
  Top 0.508: R3.2 R8.1
N$9
  Top 0.508: R8.2 R13.1
N$10
  Top 0.508: R10.1 R9.2
N$11
  Top 0.508: R10.2 R11.1
N$12
  Top 0.508: R11.2 R12.1
N$13
  Top 0.508: R14.1 R12.2
N$14
  Top 0.508: R13.2 R18.1
N$15
  Top 0.508: 6.1,8.38 12.45,8.38 17.53,3.3 R53.2 | R15.2 R53.2 | R14.2 R45.2 37.9,10.79 37.9,10.07 36.13,8.3 R53.2
  Top 0.61: C2.2 6.1,8.38 6.1,9.84 4,11.94 JP1.3
N$19
  Top 0.508: R18.2 R23.1
N$24
  Top 0.508: R23.2 19.3,22.61 18.54,21.84 18.54,11.92 19.29,11.18 R28.1
N$29
  Top 0.508: R33.1 R28.2
N$34
  Top 0.508: R33.2 R38.1
N$39
  Top 0.508: R38.2 R43.1
N$40
  Top 0.508: LED3.A R46.2
N$41
  Top 0.508: R43.2 R45.1
N$42
  Top 0.508: R47.2 R48.1
N$43
  Top 0.508: R48.2 R49.1
N$44
  Top 0.508: R49.2 R50.1
N$45
  Top 0.508: R50.2 R51.1
N$46
  Top 0.508: R51.2 19.3,47.61 18.54,46.84 18.54,36.92 19.29,36.18 R52.1
N$47
  Top 0.508: R54.1 R52.2
N$48
  Top 0.508: R54.2 R55.1
N$49
  Top 0.508: R55.2 R56.1
N$50
  Top 0.508: R56.2 R57.1
N$51
  Top 0.508: R60.1 R59.2
N$52
  Top 0.508: R61.1 R60.2
N$53
  Top 0.508: R62.1 R61.2
N$54
  Top 0.508: R63.1 R62.2
N$55
  Top 0.508: R63.2 R64.1
N$56
  Top 0.508: R65.1 R64.2
N$57
  Top 0.508: R65.2 R66.1
N$58
  Top 0.508: R66.2 R67.1
N$59
  Top 0.508: R68.1 R67.2
N$60
  Top 0.508: 6.1,33.38 12.45,33.38 17.53,28.3 R58.2 | R69.2 R58.2 | R68.2 R57.2 37.9,35.79 37.9,35.07 36.13,33.3 R58.2
  Top 0.61: C6.2 6.1,33.38 6.1,34.84 4,36.94 JP7.3
N$61
  Top 0.508: LED4.A R70.2
N$62
  Top 0.508: R71.2 R72.1
N$63
  Top 0.508: R72.2 R73.1
N$64
  Top 0.508: R73.2 R74.1
N$65
  Top 0.508: R74.2 R75.1
N$66
  Top 0.508: R75.2 19.3,72.61 18.54,71.84 18.54,61.92 19.29,61.18 R76.1
N$67
  Top 0.508: R77.1 R76.2
N$68
  Top 0.508: R77.2 R78.1
N$69
  Top 0.508: R78.2 R79.1
N$70
  Top 0.508: R79.2 R80.1
N$71
  Top 0.508: R83.1 R82.2
N$72
  Top 0.508: R84.1 R83.2
N$73
  Top 0.508: R85.1 R84.2
N$74
  Top 0.508: R86.1 R85.2
N$75
  Top 0.508: R86.2 R87.1
N$76
  Top 0.508: R88.1 R87.2
N$77
  Top 0.508: R88.2 R89.1
N$78
  Top 0.508: R89.2 R90.1
N$79
  Top 0.508: R91.1 R90.2
N$80
  Top 0.508: 6.1,58.38 12.45,58.38 17.53,53.3 R81.2 | R92.2 R81.2 | R91.2 R80.2 37.9,60.79 37.9,60.07 36.13,58.3 R81.2
  Top 0.61: C8.2 6.1,58.38 6.1,59.84 4,61.94 JP10.3
N$81
  Top 0.508: LED5.A R93.2
N$82
  Top 0.508: R94.2 R95.1
N$83
  Top 0.508: R95.2 R96.1
N$84
  Top 0.508: R96.2 R97.1
N$85
  Top 0.508: R97.2 R98.1
N$86
  Top 0.508: R98.2 68.3,22.61 67.54,21.84 67.54,11.92 68.29,11.18 R99.1
N$87
  Top 0.508: R100.1 R99.2
N$88
  Top 0.508: R100.2 R101.1
N$89
  Top 0.508: R101.2 R102.1
N$90
  Top 0.508: R102.2 R103.1
N$91
  Top 0.508: R106.1 R105.2
N$92
  Top 0.508: R107.1 R106.2
N$93
  Top 0.508: R108.1 R107.2
N$94
  Top 0.508: R109.1 R108.2
N$95
  Top 0.508: R109.2 R110.1
N$96
  Top 0.508: R111.1 R110.2
N$97
  Top 0.508: R111.2 R112.1
N$98
  Top 0.508: R112.2 R113.1
N$99
  Top 0.508: R114.1 R113.2
N$100
  Top 0.508: 55.1,8.38 61.45,8.38 66.53,3.3 R104.2 | R115.2 R104.2 | R114.2 R103.2 86.9,10.79 86.9,10.07 85.13,8.3 R104.2
  Top 0.61: C10.2 55.1,8.38 55.1,9.84 53,11.94 JP13.3
N$101
  Top 0.508: LED6.A R116.2
N$102
  Top 0.508: R117.2 R118.1
N$103
  Top 0.508: R118.2 R119.1
N$104
  Top 0.508: R119.2 R120.1
N$105
  Top 0.508: R120.2 R121.1
N$106
  Top 0.508: R121.2 19.3,97.61 18.54,96.84 18.54,86.92 19.29,86.18 R122.1
N$107
  Top 0.508: R123.1 R122.2
N$108
  Top 0.508: R123.2 R124.1
N$109
  Top 0.508: R124.2 R125.1
N$110
  Top 0.508: R125.2 R126.1
N$111
  Top 0.508: R129.1 R128.2
N$112
  Top 0.508: R130.1 R129.2
N$113
  Top 0.508: R131.1 R130.2
N$114
  Top 0.508: R132.1 R131.2
N$115
  Top 0.508: R132.2 R133.1
N$116
  Top 0.508: R134.1 R133.2
N$117
  Top 0.508: R134.2 R135.1
N$118
  Top 0.508: R135.2 R136.1
N$119
  Top 0.508: R137.1 R136.2
N$120
  Top 0.508: 6.1,83.38 12.45,83.38 17.53,78.3 R127.2 | R138.2 R127.2 | R137.2 R126.2 37.9,85.79 37.9,85.07 36.13,83.3 R127.2
  Top 0.61: C12.2 6.1,83.38 6.1,84.84 4,86.94 JP16.3
N$121
  Top 0.508: LED7.A R139.2
N$122
  Top 0.508: R140.2 R141.1
N$123
  Top 0.508: R141.2 R142.1
N$124
  Top 0.508: R142.2 R143.1
N$125
  Top 0.508: R143.2 R144.1
N$126
  Top 0.508: R144.2 68.3,47.61 67.54,46.84 67.54,36.92 68.29,36.18 R145.1
N$127
  Top 0.508: R146.1 R145.2
N$128
  Top 0.508: R146.2 R147.1
N$129
  Top 0.508: R147.2 R148.1
N$130
  Top 0.508: R148.2 R149.1
N$131
  Top 0.508: R152.1 R151.2
N$132
  Top 0.508: R153.1 R152.2
N$133
  Top 0.508: R154.1 R153.2
N$134
  Top 0.508: R155.1 R154.2
N$135
  Top 0.508: R155.2 R156.1
N$136
  Top 0.508: R157.1 R156.2
N$137
  Top 0.508: R157.2 R158.1
N$138
  Top 0.508: R158.2 R159.1
N$139
  Top 0.508: R160.1 R159.2
N$140
  Top 0.508: 55.1,33.38 61.45,33.38 66.53,28.3 R150.2 | R161.2 R150.2 | R160.2 R149.2 86.9,35.79 86.9,35.07 85.13,33.3 R150.2
  Top 0.61: C14.2 55.1,33.38 55.1,34.84 53,36.94 JP19.3
N$141
  Top 0.508: LED8.A R162.2
N$142
  Top 0.508: R163.2 R164.1
N$143
  Top 0.508: R164.2 R165.1
N$144
  Top 0.508: R165.2 R166.1
N$145
  Top 0.508: R166.2 R167.1
N$146
  Top 0.508: R167.2 68.3,72.61 67.54,71.84 67.54,61.92 68.29,61.18 R168.1
N$147
  Top 0.508: R169.1 R168.2
N$148
  Top 0.508: R169.2 R170.1
N$149
  Top 0.508: R170.2 R171.1
N$150
  Top 0.508: R171.2 R172.1
N$151
  Top 0.508: R175.1 R174.2
N$152
  Top 0.508: R176.1 R175.2
N$153
  Top 0.508: R177.1 R176.2
N$154
  Top 0.508: R178.1 R177.2
N$155
  Top 0.508: R178.2 R179.1
N$156
  Top 0.508: R180.1 R179.2
N$157
  Top 0.508: R180.2 R181.1
N$158
  Top 0.508: R181.2 R182.1
N$159
  Top 0.508: R183.1 R182.2
N$160
  Top 0.508: 55.1,58.38 61.45,58.38 66.53,53.3 R173.2 | R184.2 R173.2 | R183.2 R172.2 86.9,60.79 86.9,60.07 85.13,58.3 R173.2
  Top 0.61: C16.2 55.1,58.38 55.1,59.84 53,61.94 JP22.3
N$161
  Top 0.508: LED9.A R185.2
N$162
  Top 0.508: R186.2 R187.1
N$163
  Top 0.508: R187.2 R188.1
N$164
  Top 0.508: R188.2 R189.1
N$165
  Top 0.508: R189.2 R190.1
N$166
  Top 0.508: R190.2 68.3,97.61 67.54,96.84 67.54,86.92 68.29,86.18 R191.1
N$167
  Top 0.508: R192.1 R191.2
N$168
  Top 0.508: R192.2 R193.1
N$169
  Top 0.508: R193.2 R194.1
N$170
  Top 0.508: R194.2 R195.1
N$171
  Top 0.508: R198.1 R197.2
N$172
  Top 0.508: R199.1 R198.2
N$173
  Top 0.508: R200.1 R199.2
N$174
  Top 0.508: R201.1 R200.2
N$175
  Top 0.508: R201.2 R202.1
N$176
  Top 0.508: R203.1 R202.2
N$177
  Top 0.508: R203.2 R204.1
N$178
  Top 0.508: R204.2 R205.1
N$179
  Top 0.508: R206.1 R205.2
N$180
  Top 0.508: 55.1,83.38 61.45,83.38 66.53,78.3 R196.2 | R207.2 R196.2 | R206.2 R195.2 86.9,85.79 86.9,85.07 85.13,83.3 R196.2
  Top 0.61: C18.2 55.1,83.38 55.1,84.84 53,86.94 JP25.3
N$241
  Top 0.508: LED13.A R277.2
N$242
  Top 0.508: R278.2 R279.1
N$243
  Top 0.508: R279.2 R280.1
N$244
  Top 0.508: R280.2 R281.1
N$245
  Top 0.508: R281.2 R282.1
N$246
  Top 0.508: R282.2 117.3,22.61 116.54,21.84 116.54,11.92 117.29,11.18 R283.1
N$247
  Top 0.508: R284.1 R283.2
N$248
  Top 0.508: R284.2 R285.1
N$249
  Top 0.508: R285.2 R286.1
N$250
  Top 0.508: R286.2 R287.1
N$251
  Top 0.508: R290.1 R289.2
N$252
  Top 0.508: R291.1 R290.2
N$253
  Top 0.508: R292.1 R291.2
N$254
  Top 0.508: R293.1 R292.2
N$255
  Top 0.508: R293.2 R294.1
N$256
  Top 0.508: R295.1 R294.2
N$257
  Top 0.508: R295.2 R296.1
N$258
  Top 0.508: R296.2 R297.1
N$259
  Top 0.508: R298.1 R297.2
N$260
  Top 0.508: 104.1,8.38 110.45,8.38 115.53,3.3 R288.2 | R299.2 R288.2 | R298.2 R287.2 135.9,10.79 135.9,10.07 134.13,8.3 R288.2
  Top 0.61: C26.2 104.1,8.38 104.1,9.84 102,11.94 JP37.3
N$261
  Top 0.508: LED14.A R300.2
N$262
  Top 0.508: R301.2 R302.1
N$263
  Top 0.508: R302.2 R303.1
N$264
  Top 0.508: R303.2 R304.1
N$265
  Top 0.508: R304.2 R305.1
N$266
  Top 0.508: R305.2 117.3,47.61 116.54,46.84 116.54,36.92 117.29,36.18 R306.1
N$267
  Top 0.508: R307.1 R306.2
N$268
  Top 0.508: R307.2 R308.1
N$269
  Top 0.508: R308.2 R309.1
N$270
  Top 0.508: R309.2 R310.1
N$271
  Top 0.508: R313.1 R312.2
N$272
  Top 0.508: R314.1 R313.2
N$273
  Top 0.508: R315.1 R314.2
N$274
  Top 0.508: R316.1 R315.2
N$275
  Top 0.508: R316.2 R317.1
N$276
  Top 0.508: R318.1 R317.2
N$277
  Top 0.508: R318.2 R319.1
N$278
  Top 0.508: R319.2 R320.1
N$279
  Top 0.508: R321.1 R320.2
N$280
  Top 0.508: 104.1,33.38 110.45,33.38 115.53,28.3 R311.2 | R322.2 R311.2 | R321.2 R310.2 135.9,35.79 135.9,35.07 134.13,33.3 R311.2
  Top 0.61: C28.2 104.1,33.38 104.1,34.84 102,36.94 JP40.3
N$281
  Top 0.508: LED15.A R323.2
N$282
  Top 0.508: R324.2 R325.1
N$283
  Top 0.508: R325.2 R326.1
N$284
  Top 0.508: R326.2 R327.1
N$285
  Top 0.508: R327.2 R328.1
N$286
  Top 0.508: R328.2 117.3,72.61 116.54,71.84 116.54,61.92 117.29,61.18 R329.1
N$287
  Top 0.508: R330.1 R329.2
N$288
  Top 0.508: R330.2 R331.1
N$289
  Top 0.508: R331.2 R332.1
N$290
  Top 0.508: R332.2 R333.1
N$291
  Top 0.508: R336.1 R335.2
N$292
  Top 0.508: R337.1 R336.2
N$293
  Top 0.508: R338.1 R337.2
N$294
  Top 0.508: R339.1 R338.2
N$295
  Top 0.508: R339.2 R340.1
N$296
  Top 0.508: R341.1 R340.2
N$297
  Top 0.508: R341.2 R342.1
N$298
  Top 0.508: R342.2 R343.1
N$299
  Top 0.508: R344.1 R343.2
N$300
  Top 0.508: 104.1,58.38 110.45,58.38 115.53,53.3 R334.2 | R345.2 R334.2 | R344.2 R333.2 135.9,60.79 135.9,60.07 134.13,58.3 R334.2
  Top 0.61: C30.2 104.1,58.38 104.1,59.84 102,61.94 JP43.3
N$301
  Top 0.508: LED16.A R346.2
N$302
  Top 0.508: R347.2 R348.1
N$303
  Top 0.508: R348.2 R349.1
N$304
  Top 0.508: R349.2 R350.1
N$305
  Top 0.508: R350.2 R351.1
N$306
  Top 0.508: R351.2 117.3,97.61 116.54,96.84 116.54,86.92 117.29,86.18 R352.1
N$307
  Top 0.508: R353.1 R352.2
N$308
  Top 0.508: R353.2 R354.1
N$309
  Top 0.508: R354.2 R355.1
N$310
  Top 0.508: R355.2 R356.1
N$311
  Top 0.508: R359.1 R358.2
N$312
  Top 0.508: R360.1 R359.2
N$313
  Top 0.508: R361.1 R360.2
N$314
  Top 0.508: R362.1 R361.2
N$315
  Top 0.508: R362.2 R363.1
N$316
  Top 0.508: R364.1 R363.2
N$317
  Top 0.508: R364.2 R365.1
N$318
  Top 0.508: R365.2 R366.1
N$319
  Top 0.508: R367.1 R366.2
N$320
  Top 0.508: 104.1,83.38 110.45,83.38 115.53,78.3 R357.2 | R368.2 R357.2 | R367.2 R356.2 135.9,85.79 135.9,85.07 134.13,83.3 R357.2
  Top 0.61: C32.2 104.1,83.38 104.1,84.84 102,86.94 JP46.3

## Text on the board
tNames: HV+ | HV+ | HV+ | HV- | HV- | HV- | HV+ | HV+ | HV+ | HV- | HV- | HV- | HV+ | HV+ | HV+ | HV- | HV- | HV- | HV+ | HV+ | HV+ | HV- | HV- | HV-
bNames: HV+ | HV+ | HV+ | HV- | HV- | HV- | HV+ | HV+ | HV+ | HV- | HV- | HV- | HV+ | HV+ | HV+ | HV- | HV- | HV- | HV+ | HV+ | HV+ | HV- | HV- | HV-